# EAGLE design design1 (EAGLE 7.3.0)
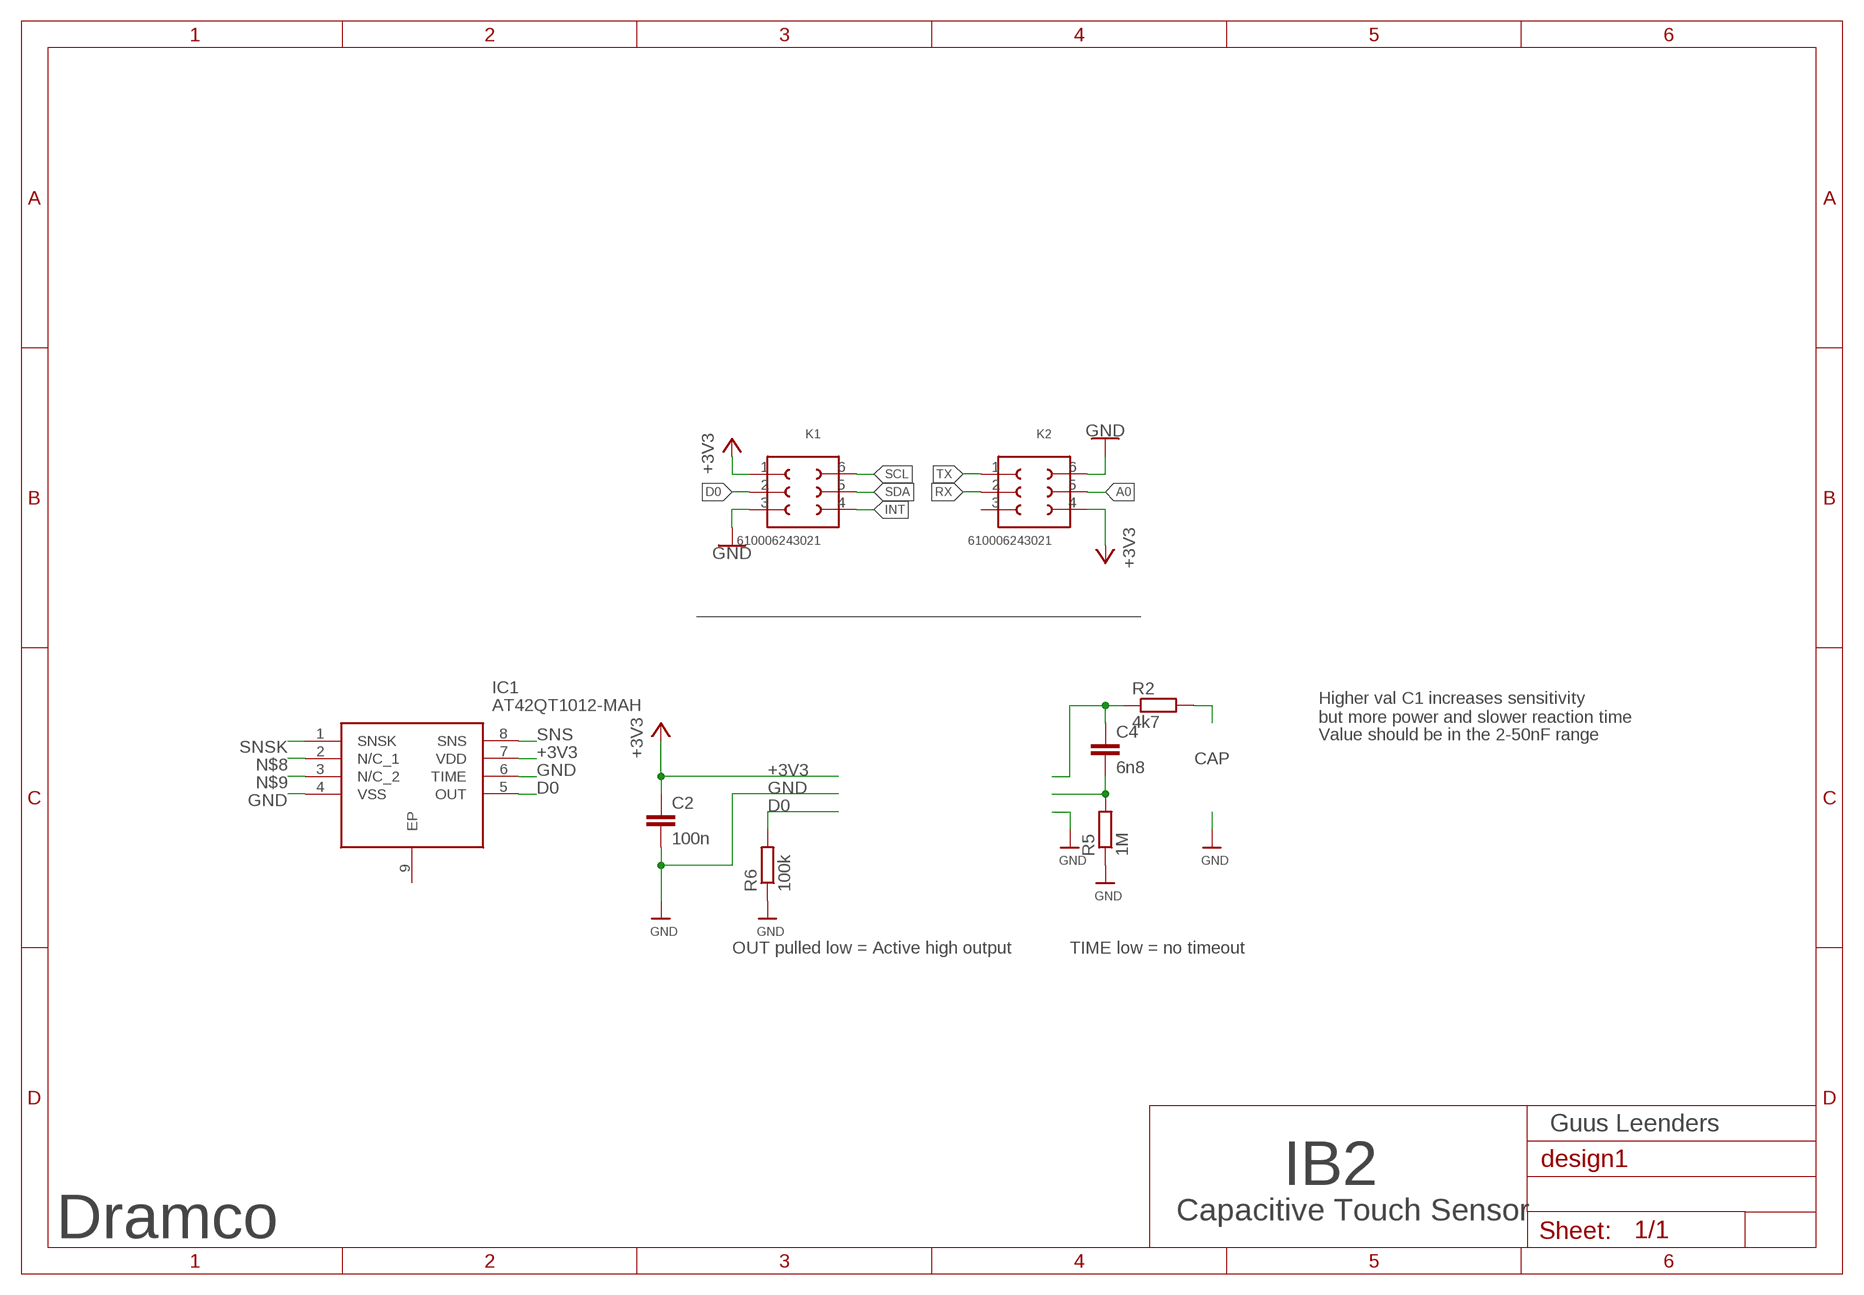
[diagram p0: schematic, sheet 1]

## Parts
C2  100n  C-EUC0603  [C0603]
C4  6n8  C-EUC0603  [C0603]
IC1  AT42QT1012-MAH  [SON50P200X200X60-9N]
K1  610006243021  [610006243021]
K2  610006243021  [610006243021]
R2  4k7  R-EU_R0603  [R0603]
R5  1M  R-EU_R0603  [R0603]
R6  100k  R-EU_R0603  [R0603]

## Nets
+3V3: C2.1 IC1.7(VDD) K1.1 K2.4
A0: K2.5
D0: IC1.5(OUT) K1.2 R6.2
GND: C2.2 IC1.4(VSS) IC1.6(TIME) K1.3 K2.6 R5.1 R6.1
INT: K1.4
N$1: R2.2
N$8: IC1.2(N/C_1)
N$9: IC1.3(N/C_2)
RX: K2.2
SCL: K1.6
SDA: K1.5
SNS: C4.2 IC1.8(SNS) R5.2
SNSK: C4.1 IC1.1(SNSK) R2.1
TX: K2.1
Unconnected: IC1.9(EP) K2.3

## Notes on the sheet
- Higher val C1 increases sensitivity
  but more power and slower reaction time
- Value should be in the 2-50nF range
- CAP
- OUT pulled low = Active high output | TIME low = no timeout
- Guus Leenders
- IB2
- Capacitive Touch Sensor
- Dramco

## Library data of the parts
C2 C4 = rcl:C-EU: CAPACITOR, European symbol
IC1 = SamacSys_Parts:AT42QT1012-MAH: Capacitive Touch Sensors One-Channel Touch Sensor IC Source: Datasheet <http://ww1.microchip.com/downloads/en/devicedoc/40001948a.pdf>; DESCRIPTION: Capacitive Touch Sensors One-Channel Touch Sensor IC; HEIGHT: 0.6mm; MANUFACTURER_NAME: Microchip; MANUFACTURER_PART_NUMBER: AT42QT1012-MAH; MOUSER_PART_NUMBER: 556-AT42QT1012-MAH; MOUSER_PRICE-STOCK: https://www.mouser.co.uk/ProductDetail/Microchip-Technology-Atmel/AT42QT1012-MAH?qs=xbJoyvfFV%2F%2FoWu%252Bxm1uZYg%3D%3D
K1 K2 = Wurth_Elektronik_Electromechanic_Board_to_Board_Connectors_rev15c:610006243021: WR-PHD 2.54mm SMT Dual Socket Header Bottom Entry, 6 Pins=>Code : Con_BTB_SHD_2.54_2_610006243021 <http://katalog.we-online.de/media/images/eican/Con_BTB_SHD_2.54_2_6100xx243021_pf2.jpg> Details see: http://katalog.we-online.de/en/em/610_0xx_243_021 Created 2014-05-30, Karrer Zheng 2014 (C) Würth Elektronik
R2 R5 R6 = rcl:R-EU_: RESISTOR, European symbol

## Board
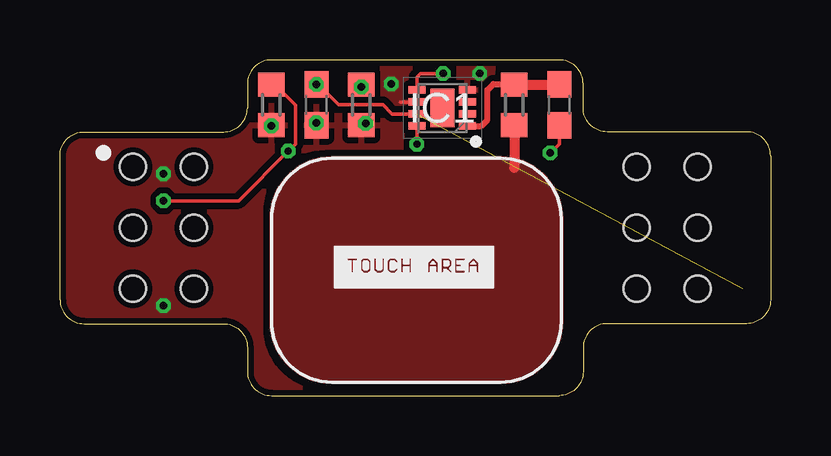
[diagram p1: board, top side]
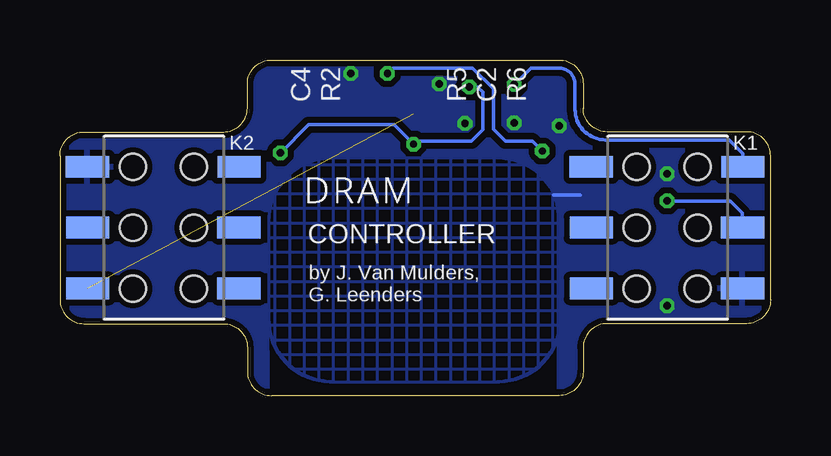
[diagram p2: board, bottom side, seen from below]

Size 29.63 x 14 mm. Coordinates in mm from the lower left corner, seen from the top.
Outline: 0,4 0,10 arc-90 1,11 6.81,11 arc90 7.81,12 7.81,13 arc-90 8.81,14 20.81,14 arc-90 21.81,13 21.81,12 arc90 22.81,11 28.63,11 arc-90 29.63,10 29.63,4 arc-90 28.63,3 22.81,3 arc90 21.81,2 21.81,1 arc-90 20.81,0 8.81,0 arc-90 7.81,1 7.81,2 arc90 6.81,3 1,3 arc-90 0,4
Copper layers (1*16): Top 0.035mm / dielectric 1.5mm / Bottom 0.035mm
Design rules "SeeedStudio_2layer_DRU_no_angle_20140221": minimum track width 6mil, minimum drill 12mil, track to track 6mil, track to pad 6mil, pad to pad 6mil, via to via 6mil, smd to smd 0mil, copper to edge 10mil, drill to drill 10mil, minimum pad ring 10mil, minimum via ring 6mil, stop-mask expansion 2mil, vias tented up to drill 100mil, thermal gap 10mil

### Footprints (pad centres in the part's own frame; a part is rotated, then mirrored left to right if it is on the bottom)
C0603 = smd 1.1 x 1: 1 -0.85,0; 2 0.85,0
SON50P200X200X60-9N = smd 0.7 x 0.3: 1 -1.05,0.75; 2 -1.05,0.25; 3 -1.05,-0.25; 4 -1.05,-0.75; 5 1.05,-0.75; 6 1.05,-0.25; 7 1.05,0.25; 8 1.05,0.75 | smd 1 x 1.6: 9 0,0
610006243021 = smd 0.9 x 1.8: 1 -2.54,3.15; 2 -0.01,3.14; 3 2.53,3.14; 4 2.53,-3.16; 5 -0.01,-3.16; 6 -2.54,-3.17 | hole 1.1: -2.54,1.27; 0,1.27; 0,-1.27; -2.54,-1.27; 2.54,1.27; 2.54,-1.27
R0603 = smd 1 x 1.1: 1 -0.85,0; 2 0.85,0

### Placement (x,y rotation side)
C2  10.69,12.12 270 top
C4  20.81,12.12 270 top
IC1  15.94,12 180 top
K1  4.31,7 270 bottom
K2  25.31,7 270 bottom
R2  18.94,12.12 270 top
R5  12.56,12.12 90 top
R6  8.81,12.12 90 top

### Tracks (layer width: path | path; a pad name or v marks a point on that pad's centre or on a via)
+3V3  (via drill 0.3)  (1 unrouted)
  Top 0.152: 10.39,12.55 10.69,12.85 C2.1 10.77,12.98 11.61,12.14 13.46,12.14 13.85,11.75 IC1.7
  Bottom 0.152: K1.1 1.16,10.1 1.73,10.66 6.88,10.66 arc90 8.15,11.94 8.15,12.98 arc-90 8.84,13.66 10,13.66 C2.1
  other vias: 10.69,12.98
D0  (via drill 0.3)
  Top 0.152: R6.2 8.96,12.98 9.81,12.12 9.81,10.5 v9.52,10.2 7.44,8.12 v4.31,8.12 | v15.98,13.43 15.04,13.43 14.88,13.28 IC1.5
  Bottom 0.152: v9.52,10.2 9.94,10.62 11.06,10.62 11.56,11.12 11.56,12.81 12.42,13.66 15.75,13.66 v15.98,13.43 | K1.2 1.17,7.61 1.69,8.12 v4.31,8.12
GND  (via drill 0.31)
  Top 0.152: IC1.6 14.19,12.25
  Bottom 0.152: 7.94,8.38 9.06,8.38
  other vias: 4.31,3.75 10.69,11.38 8.81,11.25 4.31,9.25 13.81,13 17.5,13.43 12.74,11.35
  pour Bottom (isolate 0.254, rank 6): -4.19,17 33.56,17 33.56,-3.75 20.94,-3.88 21.06,6 21.06,7.5 arc90 18.56,10 11.31,10 arc90 8.81,7.5 8.81,-3.75 -4.19,-3.75
  pour Top (isolate 0.254, rank 6): -4.44,18.75 36.06,18.75 36.06,-4.75 -3.94,-4.75 arc-90 -4.44,-4.25
  pour Bottom (hatched): 20.91,3.1 20.91,7.4 arc90 18.37,9.94 11.32,9.94 arc90 8.78,7.4 8.78,3.1 arc90 11.32,0.56 18.37,0.56 arc90
N$1
  Top 0.406: R2.2 18.94,9.5
  pour Top: 8.79,3.09 8.79,7.38 arc-90 11.33,9.92 18.38,9.92 arc-90 20.92,7.38 20.92,3.09 arc-90 18.38,0.55 11.33,0.55 arc-90
SNS  (via drill 0.3)
  Top 0.152: C4.2 20.81,10.5 v20.44,10.12 | v14.88,10.49 IC1.8 | R5.2 v12.56,12.88
  Top 0.406: R5.2 arc90 R5.2
  Bottom 0.152: v20.44,10.12 19.27,11.3 15.7,11.3 v14.88,10.49 14.76,10.62 12.47,10.62 11.99,11.1 11.99,12.65 12.22,12.88 v12.56,12.88
SNSK
  Top 0.254: IC1.1 17.56,11.25 17.81,11.5 17.81,12.75 18.06,13 18.91,13 R2.1
  Top 0.406: R2.1 arc-90 R2.1 | R2.1 C4.1

### Text on the board
bPlace: by J. Van Mulders, / G. Leenders
bNames: CONTROLLER